# EAGLE design VGA-OSCI (EAGLE 6.6.0)
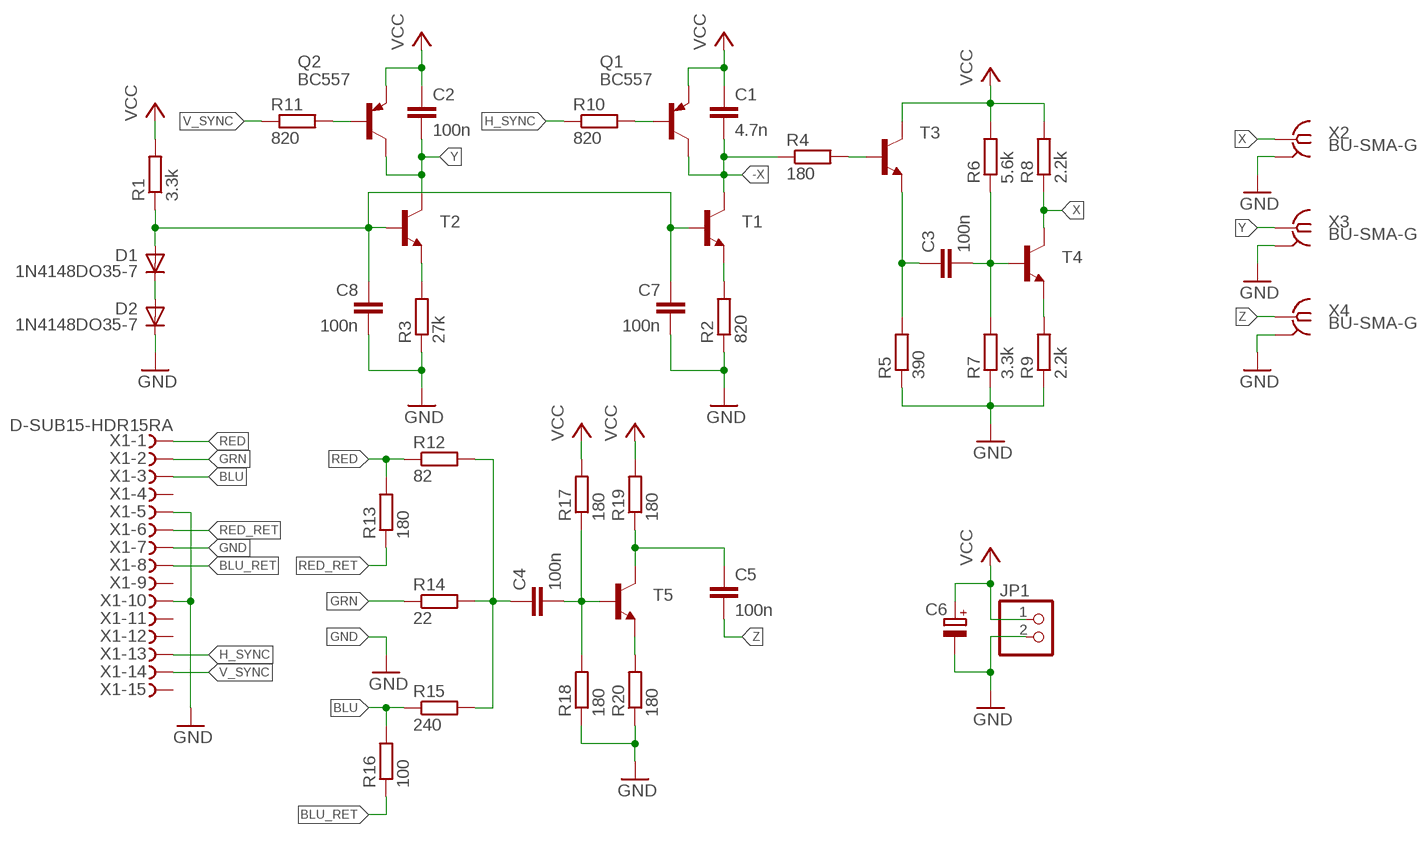
[diagram p0: schematic, sheet 1]

## Parts
C1  4.7n  C-EU050-024X044  [C050-024X044]
C2  100n  C-EU050-024X044  [C050-024X044]
C3  100n  C-EU050-024X044  [C050-024X044]
C4  100n  C-EU050-024X044  [C050-024X044]
C5  100n  C-EU050-024X044  [C050-024X044]
C6  CPOL-EUB45181A  [B45181A]
C7  100n  C-EU050-024X044  [C050-024X044]
C8  100n  C-EU050-024X044  [C050-024X044]
D1  1N4148DO35-7  [DO35-7]
D2  1N4148DO35-7  [DO35-7]
JP1  PINHD-1X2  [1X02]
Q1  BC557  [TO92-EBC]
Q2  BC557  [TO92-EBC]
R1  3.3k  R-EU_0204/7  [0204/7]
R2  820  R-EU_0204/7  [0204/7]
R3  27k  R-EU_0204/7  [0204/7]
R4  180  R-EU_0204/7  [0204/7]
R5  390  R-EU_0204/7  [0204/7]
R6  5.6k  R-EU_0204/7  [0204/7]
R7  3.3k  R-EU_0204/7  [0204/7]
R8  2.2k  R-EU_0204/7  [0204/7]
R9  2.2k  R-EU_0204/7  [0204/7]
R10  820  R-EU_0204/7  [0204/7]
R11  820  R-EU_0204/7  [0204/7]
R12  82  R-EU_0204/7  [0204/7]
R13  180  R-EU_0204/7  [0204/7]
R14  22  R-EU_0204/7  [0204/7]
R15  240  R-EU_0204/7  [0204/7]
R16  100  R-EU_0204/7  [0204/7]
R17  180  R-EU_0204/7  [0204/7]
R18  180  R-EU_0204/7  [0204/7]
R19  180  R-EU_0204/7  [0204/7]
R20  180  R-EU_0204/7  [0204/7]
T1  BC547-NPN-TO92-CBE  [TO92-CBE]
T2  BC547-NPN-TO92-CBE  [TO92-CBE]
T3  BC547-NPN-TO92-CBE  [TO92-CBE]
T4  BC547-NPN-TO92-CBE  [TO92-CBE]
T5  BC547-NPN-TO92-CBE  [TO92-CBE]
X1  D-SUB15-HDR15RA  [HDR15RA]
X2  BU-SMA-G  [BU-SMA-G]
X3  BU-SMA-G  [BU-SMA-G]
X4  BU-SMA-G  [BU-SMA-G]

## Nets
-X: C1.2 Q1.C R4.1 T1.C
BLU: R15.1 R16.2 X1.3
BLU_RET: R16.1 X1.8
GND: C6.- C7.2 C8.2 D2.C JP1.2 R2.1 R3.1 R5.1 R7.1 R9.1 R18.1 R20.1 X1.5 X1.7 X1.10 X2.2 X2.3 X2.4 X2.5 X3.2 X3.3 X3.4 X3.5 X4.2 X4.3 X4.4 X4.5
GRN: R14.1 X1.2
GRY_SCL: C4.1 R12.2 R14.2 R15.2
H_SYNC: R10.1 X1.13
N$1: D1.C D2.A
N$2: C7.1 C8.1 D1.A R1.1 T1.B T2.B
N$3: R2.2 T1.E
N$4: R3.2 T2.E
N$5: Q2.B R11.2
N$6: R9.2 T4.E
N$7: C3.2 R6.1 R7.2 T4.B
N$8: C3.1 R5.2 T3.E
N$9: R4.2 T3.B
N$10: Q1.B R10.2
N$11: C4.2 R17.1 R18.2 T5.B
N$13: C5.1 R19.1 T5.C
N$14: R20.2 T5.E
RED: R12.1 R13.2 X1.1
RED_RET: R13.1 X1.6
V_SYNC: R11.1 X1.14
VCC: C1.1 C2.1 C6.+ JP1.1 Q1.E Q2.E R1.2 R6.2 R8.2 R17.2 R19.2 T3.C
X: R8.1 T4.C X2.1
Y: C2.2 Q2.C T2.C X3.1
Z: C5.2 X4.1
Unconnected: X1.4 X1.9 X1.11 X1.12 X1.15

## Library data of the parts
C1-C5 C7 C8 = rcl:C-EU: CAPACITOR, European symbol
C6 = rcl:CPOL-EU: POLARIZED CAPACITOR, European symbol
D1 D2 = diode:1N4148: DIODE high speed (Philips)
JP1 = pinhead:PINHD-1X2: PIN HEADER
Q1 Q2 = transistor-pnp:BC557*: PNP Transistror
R1-R20 = rcl:R-EU_: RESISTOR, European symbol
T1-T5 = transistor:*-NPN-: NPN Transistror BF959 corrected 2008.03.06
X1 = con-thomas-betts:D-SUB15-: D-Subminiatur Connector Source: Electronioc Interconnects European Edition 1998; OC_FARNELL: unknown; OC_NEWARK: unknown
X2-X4 = con-coax:BU-SMA-G: FEMALE SMA CONNECTOR Radiall distributor RS 193-9117; OC_FARNELL: unknown; OC_NEWARK: unknown

## Board
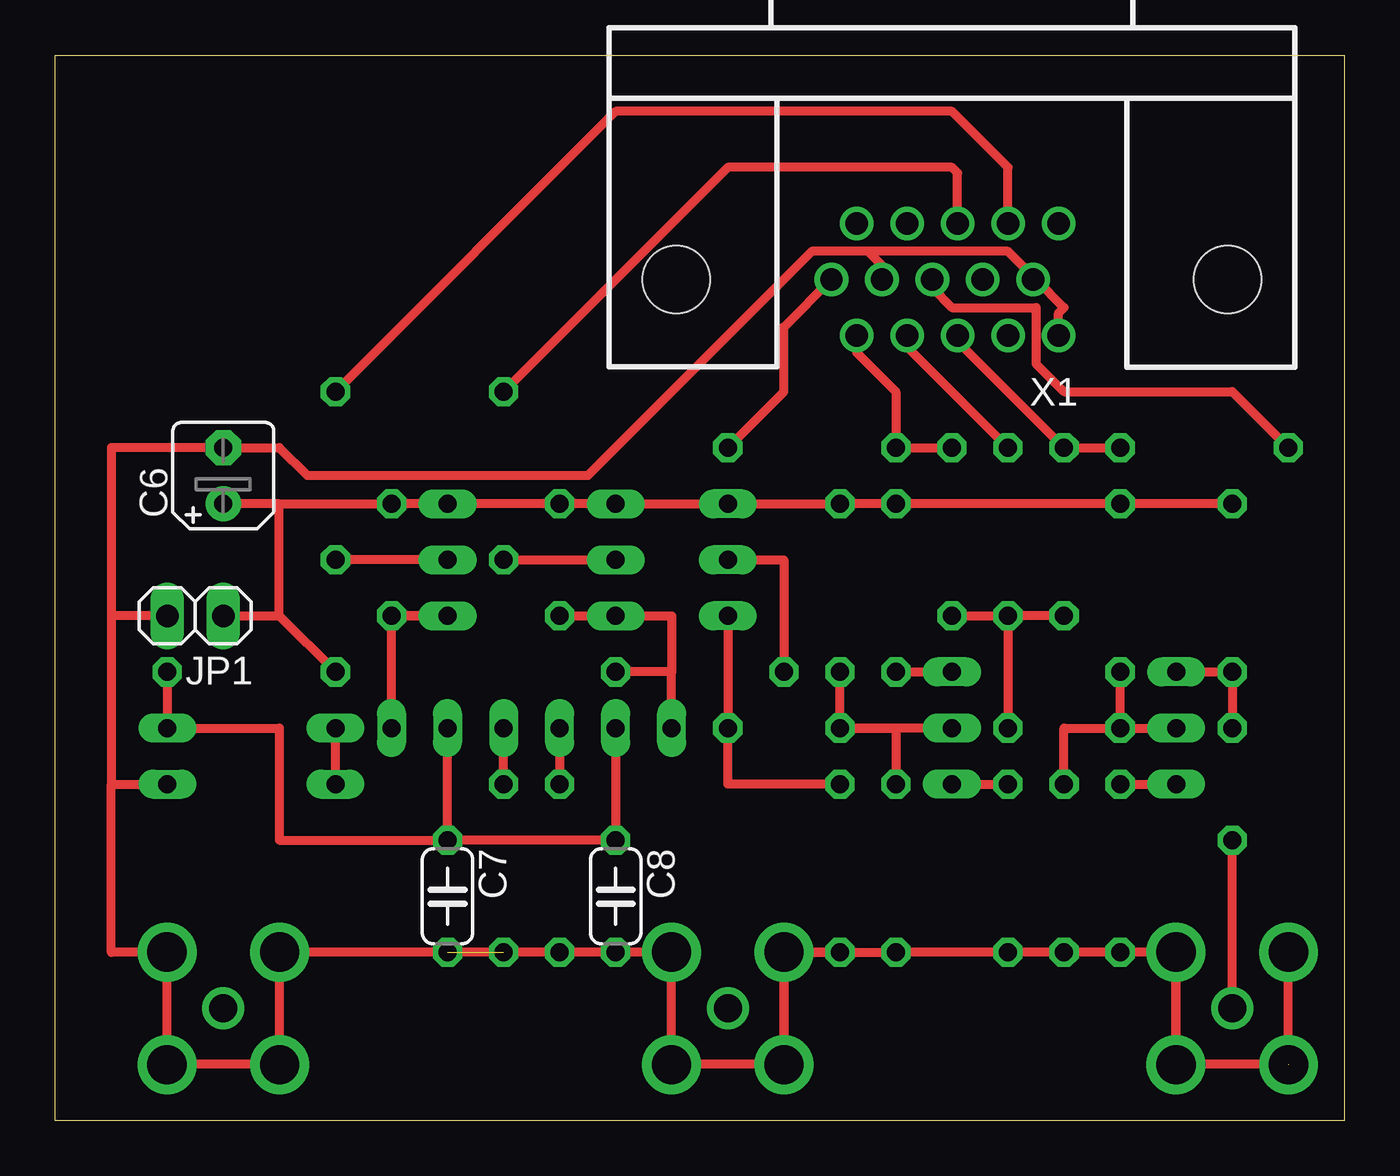
[diagram p1: board, top side]
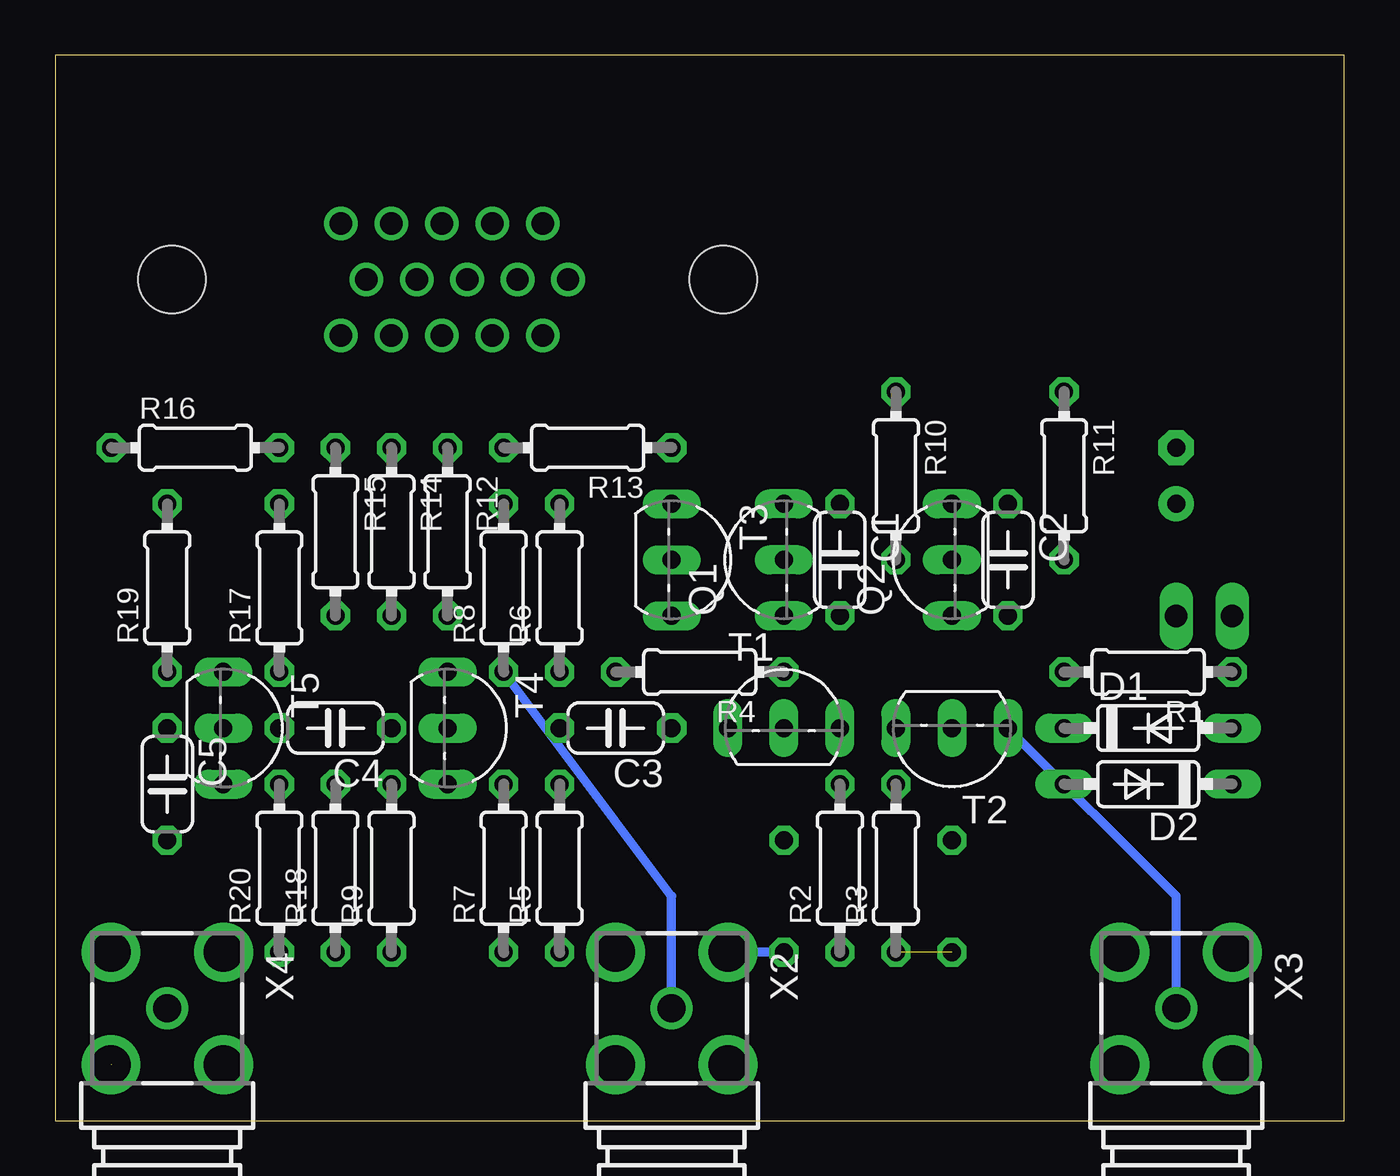
[diagram p2: board, bottom side, seen from below]

Size 58.42 x 48.26 mm. Coordinates in mm from the lower left corner, seen from the top.
Outline: 58.42,0 0,0 0,48.26 58.42,48.26 58.42,0
Copper layers (1*16): Top 0.035mm / dielectric 1.5mm / Bottom 0.035mm
Design rules "default *": minimum track width 10mil, minimum drill 24mil, track to track 8mil, track to pad 8mil, pad to pad 8mil, via to via 8mil, smd to smd 8mil, copper to edge 0mil, drill to drill 8mil, minimum pad ring 10mil, minimum via ring 8mil, stop-mask expansion 4mil, vias tented up to drill 0mil, thermal gap 10mil

### Footprints (pad centres in the part's own frame; a part is rotated, then mirrored left to right if it is on the bottom)
C050-024X044 = drill 0.813 octagon: 1 -2.54,0; 2 2.54,0
B45181A = drill 0.813 pad 1.6: + -1.27,0 | drill 0.813 pad 1.6 octagon: - 1.27,0
DO35-7 = drill 0.813 long: A 3.81,0; C -3.81,0
1X02 = drill 1.016 long: 1 -1.27,0; 2 1.27,0
TO92-EBC = drill 0.813 long: B 0,-1.27; C -2.54,-1.27; E 2.54,-1.27
0204/7 = drill 0.813 octagon: 1 -3.81,0; 2 3.81,0
TO92-CBE = drill 0.813 long: B 0,0; C -2.54,0; E 2.54,0
HDR15RA = drill 1.016: 1 4.318,2.54; 2 2.032,2.54; 3 -0.254,2.54; 4 -2.54,2.54; 5 -4.826,2.54; 6 5.461,0; 7 3.175,0; 8 0.889,0; 9 -1.397,0; 10 -3.683,0; 11 4.318,-2.54; 12 2.032,-2.54; 13 -0.254,-2.54; 14 -2.54,-2.54; 15 -4.826,-2.54 | hole 3.048: -12.497,0; 12.497,0
BU-SMA-G = drill 1.27: 1 0,0 | drill 1.778: 2 -2.55,2.55; 3 2.55,2.55; 4 2.55,-2.55; 5 -2.55,-2.55

### Placement (x,y rotation side)
C1  22.86,25.4 270 bottom
C2  15.24,25.4 270 bottom
C3  33.02,17.78 180 bottom
C4  45.72,17.78 180 bottom
C5  53.34,15.24 270 bottom
C6  7.62,29.21 90 top
C7  17.78,10.16 270 top
C8  25.4,10.16 270 top
D1  8.89,17.78 0 bottom
D2  8.89,15.24 180 bottom
JP1  6.35,22.86 180 top
Q1  26.67,25.4 90 bottom
Q2  19.05,25.4 90 bottom
R1  8.89,20.32 180 bottom
R2  22.86,11.43 90 bottom
R3  20.32,11.43 90 bottom
R4  29.21,20.32 180 bottom
R5  35.56,11.43 90 bottom
R6  35.56,24.13 90 bottom
R7  38.1,11.43 90 bottom
R8  38.1,24.13 90 bottom
R9  43.18,11.43 90 bottom
R10  20.32,29.21 270 bottom
R11  12.7,29.21 270 bottom
R12  40.64,26.67 270 bottom
R13  34.29,30.48 180 bottom
R14  43.18,26.67 270 bottom
R15  45.72,26.67 270 bottom
R16  52.07,30.48 0 bottom
R17  48.26,24.13 90 bottom
R18  45.72,11.43 90 bottom
R19  53.34,24.13 90 bottom
R20  48.26,11.43 90 bottom
T1  25.4,17.78 0 bottom
T2  17.78,17.78 180 bottom
T3  30.48,25.4 270 bottom
T4  40.64,17.78 270 bottom
T5  50.8,17.78 270 bottom
X1  40.64,38.1 180 top
X2  30.48,5.08 270 bottom
X3  7.62,5.08 270 bottom
X4  53.34,5.08 270 bottom

### Tracks (layer width: path | path; a pad name or v marks a point on that pad's centre or on a via)
-X
  Top 0.406: 27.94,20.32 27.94,22.86 Q1.C C1.2 | T1.C 27.94,20.32 | 27.94,20.32 R4.1
BLU
  Top 0.406: R16.2 R15.1 40.89,35.31 X1.3
BLU_RET
  Top 0.406: X1.8 39.75,37.72 40.64,36.83 44.45,36.83 44.45,34.29 45.72,33.02 53.34,33.02 R16.1
GND  (2 unrouted)
  Top 0.406: R7.1 R9.1 R18.1 R20.1 X4.2 | R7.1 R5.1 X2.5 X2.4 X2.3 X2.2 | X2.2 R2.1 R3.1 X3.5 | X3.2 X3.3 X3.4 X3.5 | X3.2 2.54,7.62 2.54,15.24 | 2.54,22.86 2.54,30.48 C6.- 10.16,30.48 11.43,29.21 24.13,29.21 34.29,39.37 36.83,39.37 | 2.54,22.86 2.54,15.24 | 2.54,15.24 D2.C | X4.4 X4.3 X4.2 | X3.3 X3.2 | X3.4 X3.5 | X2.3 27.93,7.61 X2.2 | X2.2 | X2.4 X2.5 R5.1 R7.1 | X4.3 X4.2 | X4.4 X4.5 | JP1.2 2.54,22.86 | 36.83,39.37 43.18,39.37 44.32,38.23 X1.10 44.45,38.1 45.72,36.83 45.47,36.58 X1.5 | X1.7 37.47,38.73 36.83,39.37
  Bottom 0.406: C8.2 X2.2
GRN
  Top 0.406: X1.2 38.61,35.05 R14.1
GRY_SCL
  Top 0.406: R15.2 R14.2 | R14.2 C4.1 | R12.2 R14.2
H_SYNC
  Top 0.406: R10.1 30.48,43.18 40.64,43.18 40.89,42.93 X1.13
N$1
  Top 0.406: D2.A D1.C
N$2
  Top 0.406: T1.B C8.1 C7.1 | R1.1 D1.A 10.16,17.78 10.16,12.7 C7.1 | C7.1 T2.B
N$3
  Top 0.406: T1.E R2.2
N$4
  Top 0.406: R3.2 T2.E
N$5
  Top 0.406: Q2.B R11.2
N$6
  Top 0.406: T4.E R9.2
N$7
  Top 0.406: C3.2 R6.1 | T4.B C3.2 | C3.2 38.1,17.78 R7.2
N$8
  Top 0.406: T3.E C3.1 30.48,15.24 R5.2
N$9
  Top 0.406: T3.B 33.02,25.4 R4.2
N$10
  Top 0.406: R10.2 Q1.B
N$11
  Top 0.406: C4.2 T5.B | R18.2 45.72,17.78 C4.2 | C4.2 R17.1
N$13
  Top 0.406: T5.C R19.1 C5.1
N$14
  Top 0.406: R20.2 T5.E
RED
  Top 0.406: R12.1 R13.2 38.1,33.02 36.32,34.8 X1.1
RED_RET
  Top 0.406: R13.1 33.02,33.02 33.02,35.94 X1.6
V_SYNC
  Top 0.406: R11.1 25.4,45.72 40.64,45.72 43.18,43.18 X1.14
VCC
  Top 0.406: 10.16,27.94 C2.1 Q2.E C1.1 Q1.E T3.C R6.2 R8.2 R17.2 R19.2 | R1.2 10.16,22.86 | 10.16,22.86 10.16,27.94 | 10.16,27.94 C6.+ | JP1.1 10.16,22.86
X
  Top 0.406: R8.1 T4.C
  Bottom 0.406: X2.1 30.48,10.16 R8.1
Y
  Top 0.406: T2.C C2.2 | C2.2 Q2.C C2.2
  Bottom 0.406: X3.1 7.62,10.16 T2.C
Z
  Top 0.406: X4.1 C5.2